# Altium schematic sheet LSM9DS1.SchDoc
size A4
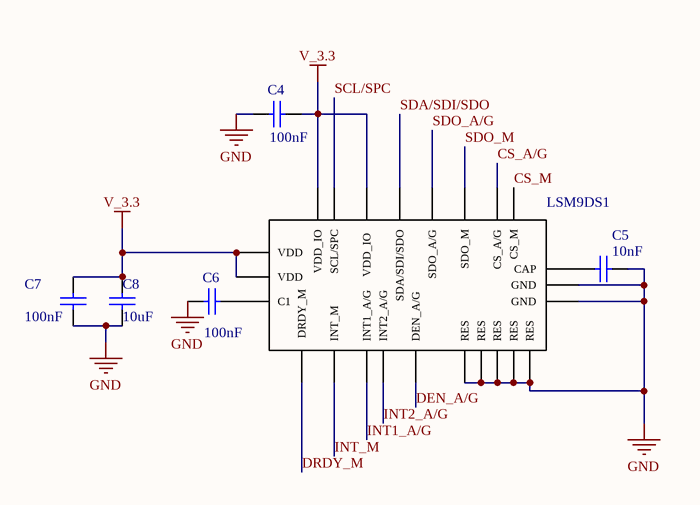
[diagram p0: LSM9DS1.SchDoc]

## Parts
C4  value 100nF  [RAD-0.3]  (hidden comment: Cap)
C5  value 10nF  [RAD-0.3]  (hidden comment: Cap)
C6  value 100nF  [RAD-0.3]  (hidden comment: Cap)
C7  value 100nF  [RAD-0.3]  (hidden comment: Cap)
C8  value 10uF  [RAD-0.3]  (hidden comment: Cap)
LSM9DS1  LSM9DS1  (value not drawn)

## Nets
GND: C4.1 C5.2 C6.1 C7.2 C8.2 LSM9DS1.13(RES) LSM9DS1.14(RES) LSM9DS1.15(RES) LSM9DS1.16(RES) LSM9DS1.17(RES) LSM9DS1.18(GND) LSM9DS1.19(GND)
V_3.3: C4.2 C7.1 C8.1 LSM9DS1.0(VDD_IO) LSM9DS1.2(VDD_IO) LSM9DS1.21(VDD) LSM9DS1.22(VDD)
CS_A/G: LSM9DS1.6(CS_A/G)
CS_M: LSM9DS1.7(CS_M)
DEN_A/G: LSM9DS1.12(DEN_A/G)
DRDY_M: LSM9DS1.8(DRDY_M)
INT1_A/G: LSM9DS1.10(INT1_A/G)
INT2_A/G: LSM9DS1.11(INT2_A/G)
INT_M: LSM9DS1.9(INT_M)
SCL/SPC: LSM9DS1.1(SCL/SPC)
SDA/SDI/SDO: LSM9DS1.3(SDA/SDI/SDO)
SDO_A/G: LSM9DS1.4(SDO_A/G)
SDO_M: LSM9DS1.5(SDO_M)
NetC5_1: C5.1 LSM9DS1.20(CAP)
NetC6_2: C6.2 LSM9DS1.23(C1)

## Library data of the parts
C4-C8 = Cap: Capacitor; Published: 8-Jun-2000; LatestRevisionDate: 17-Jul-2002; LatestRevisionNote: Re-released for DXP Platform.; PackageReference: RAD-0.3; Publisher: Altium Limited; PackageDescription: Radial Cap, Thru-Hole; 2 Leads; 0.3 in Pin Spacing